# Altium schematic sheet CONNECTOR.SchDoc
size A4; SheetNumber: 6; SheetTotal: 6
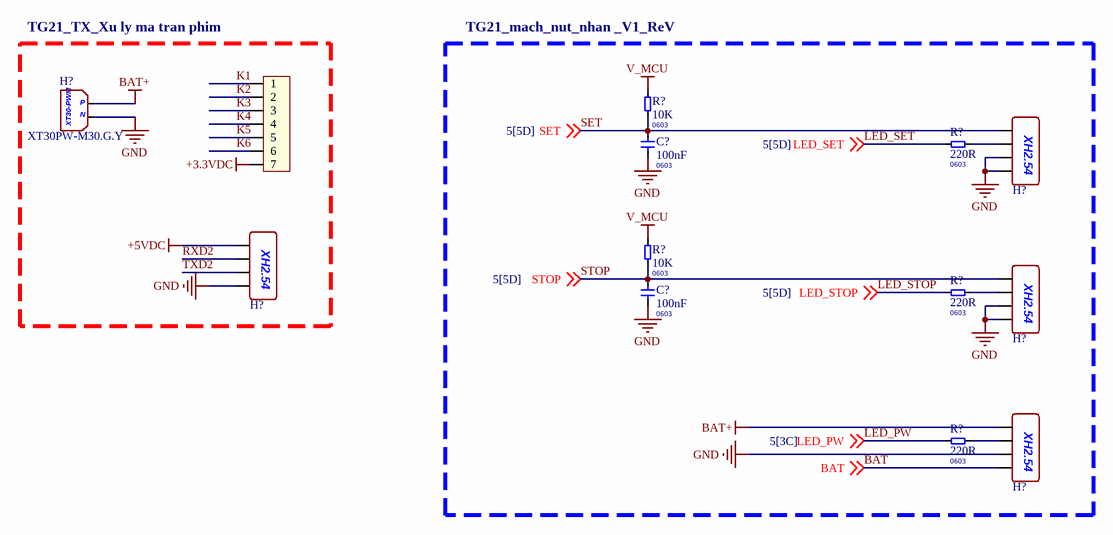
[diagram p0: CONNECTOR.SchDoc]

## Parts
(Parts that share a designator on the sheet are numbered #1, #2 ... from top to bottom, then left to right.)
C?#1  100nF  Package: 0603  [0603 MLCC]
C?#2  100nF  Package: 0603  [0603 MLCC]
H?#1  Header 7P 2.54 Duc Thang  [XH2.54M-7]  (value not drawn)
H?#2  XT30PW-M30.G.Y  [XT30]
H?#3  XY-XH2.54-4PZZ  [XH2.54 - 4PZZ]  (value not drawn)
H?#4  XY-XH2.54-4PZZ  [XH2.54 - 4PZZ]  (value not drawn)
H?#5  XY-XH2.54-4PZZ  [XH2.54 - 4PZZ]  (value not drawn)
H?#6  XY-XH2.54-4PZZ  [XH2.54 - 4PZZ]  (value not drawn)
R?#1  10K  Package: 0603  [0603 Resistors]
R?#2  220R  Package: 0603  [0603 Resistors]
R?#3  10K  Package: 0603  [0603 Resistors]
R?#4  220R  Package: 0603  [0603 Resistors]
R?#5  220R  Package: 0603  [0603 Resistors]

## Blocks framed on the sheet
TG21_TX_Xu ly ma tran phim: H?#1 H?#2 H?#4
TG21_mach_nut_nhan _V1_ReV: C?#1 C?#2 H?#3 H?#5 H?#6 R?#1-R?#5

## Nets
+3.3VDC: H?#1.7
+5VDC: H?#4.4
BAT+: H?#2.1 H?#6.4
GND: C?#1.2 C?#2.2 H?#2.2 H?#3.1 H?#3.2 H?#4.1 H?#5.1 H?#5.2 H?#6.2
V_MCU: R?#1.2 R?#3.2
BAT: H?#6.1 ; off-sheet BAT
K1: H?#1.1
K2: H?#1.2
K3: H?#1.3
K4: H?#1.4
K5: H?#1.5
K6: H?#1.6
LED_PW: R?#5.1 ; off-sheet LED_PW
LED_SET: R?#2.1 ; off-sheet LED_SET
LED_STOP: R?#4.1 ; off-sheet LED_STOP
RXD2: H?#4.3
SET: C?#1.1 H?#3.4 R?#1.1 ; off-sheet SET
STOP: C?#2.1 H?#5.4 R?#3.1 ; off-sheet STOP
TXD2: H?#4.2
NetH?#3_3: H?#3.3 R?#2.2
NetH?#5_3: H?#5.3 R?#4.2
NetH?#6_3: H?#6.3 R?#5.2

## Notes on the sheet
- Author:
- Title:
- Size:
- A4
- Project:
- Approved:
- Revision:
- Modified Date:
- CONFIDENTIAL
- Date:
- SW Version:
- (in symbol XH2.54 4PZZ) XH2.54
- (in symbol XT30PW-M30.G.Y) P; N; XT30-PWM

## Library data of the parts
C?#1 C?#2 = 0603 100nF: 100nF ±10% 50V Ceramic Capacitor X7R 0603; Manufacturer: YAGEO; Mfr. Part #: CC0603KRX7R9BB104; LCSC Part #: C14663; ComponentLink1Description: LCSC Link; ComponentLink1URL: https://www.lcsc.com/product-detail/C14663.html?s_z=n_0603%2520100nF
H?#1 = Header 7P 2.54 Duc Thang: Cắm; Ten_Linh_Kien: Header 7P XH2.54-7P Đực Thẳng; Don_Vi: Con; Ma_Hang: MH003369; Chung_Loai: Cắm
H?#2 = XT30PW-M30.G.Y: AMASS XT30PW-M30.G.Y; Manufacturer: Changzhou Amass Elec; Mfr. Part #: XT30PW-M30.G.Y; LCSC Part #: C431092; ComponentLink1Description: LCSC Link; ComponentLink1URL: https://www.lcsc.com/product-detail/C431092.html?s_z=n_q_xt30pw&spm=wm.fly.bg.0.xh&lcsc_vid=QQBdBlYAQFFWUgBXTlUPAgFQQQIIBQIHEQIPAgJRQFAxVlNRT1ddX1xWQlNaUzsOAxUeFF5JWBYZEEoKFBINSQcJGk4eFQsCAgIaSgADAwAHC0slQllfX11TQk8GEwkK; ComponentLink2Description: Datasheet; ComponentLink2URL: https://www.lcsc.com/datasheet/C431092.pdf?spm=wm.sxq.inf.ggs___wm.fly.bg.0.xh&lcsc_vid=QQBdBlYAQFFWUgBXTlUPAgFQQQIIBQIHEQIPAgJRQFAxVlNRT1ddX1xWQlNaUzsOAxUeFF5JWBYZEEoKFBINSQcJGk4eFQsCAgIaSgADAwAHC0slQllfX11TQk8GEwkK; Type: Connector/Header; Assembly Type: DIP Assembly; Value: XT30PW-M30.G.Y
H?#3-H?#6 = XH2.54 4PZZ: XH 1 4P -25℃~+85℃ 2.54mm 4 2A 250V 1x4P Through Hole,P=2.54mm Headers, Male Pins RoHS; Manufacturer: XYECONN; Mfr. Part #: XY-XH2.54-4PZZ; LCSC Part #: C53201003; ComponentLink1Description: LCSC Link; ComponentLink1URL: https://www.lcsc.com/product-detail/C53201003.html?s_z=n_XH2.54%25204P; Package: Through Hole,P=2.54mm; Type: Header; Assembly Type: DIP Assembly; ComponentLink2Description: Datasheet; ComponentLink2URL: https://www.lcsc.com/datasheet/C53201003.pdf
R?#1 R?#3 = 0603 10K: 100mW 10kΩ 75V Thick Film Resistor ±1% ±100ppm/℃ 0603 Chip Resistor - Surface Mount RoHS; Manufacturer: VISHAY; Mfr. Part #: CRCW060310K0FKEA; LCSC Part #: C844918; ComponentLink1Description: LCSC Link; ComponentLink1URL: https://www.lcsc.com/product-detail/C844918.html?s_z=n_10K
R?#2 R?#4 R?#5 = 0603 220R: 100mW 220Ω 75V Thick Film Resistor ±1% ±100ppm/℃ 0603 Chip Resistor - Surface Mount RoHS; Mfr. Part #: CRCW0603220RFKEAHP; Manufacturer: VISHAY; LCSC Part #: C313707; ComponentLink1Description: LCSC Link; ComponentLink1URL: https://www.lcsc.com/product-detail/C313707.html?s_z=n_0603%2520220R; Value: 220R